# Altium schematic sheet 7971DoubleDriver.SchDoc
size A3
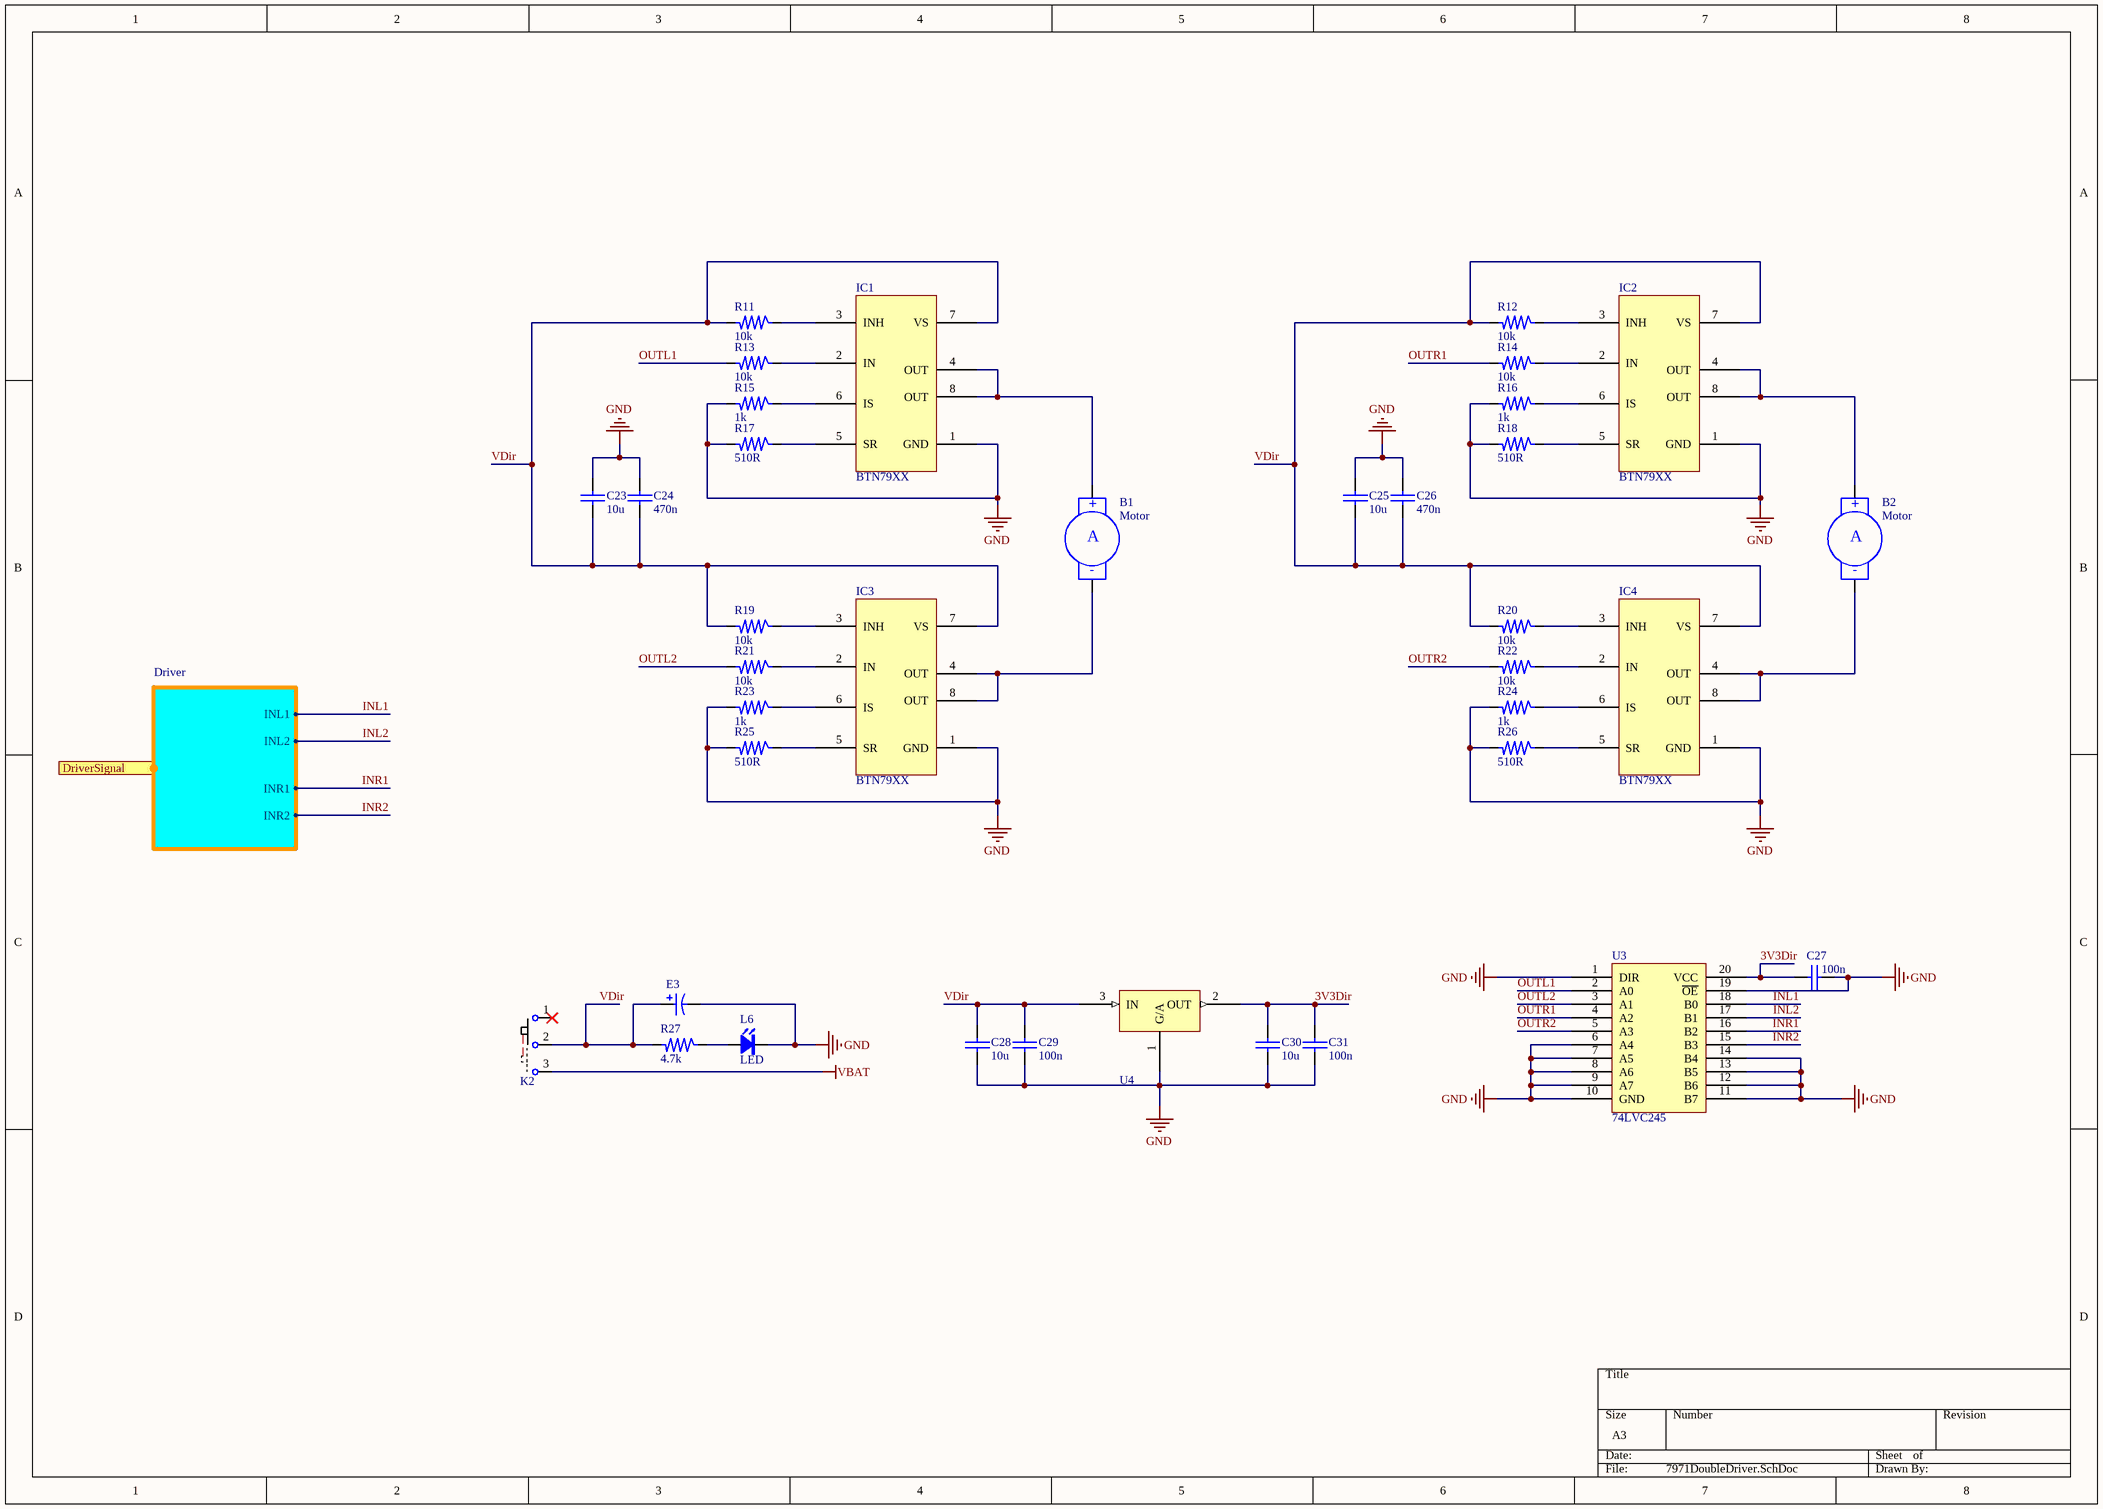
[diagram p0: 7971DoubleDriver.SchDoc]

## Parts
B1  Motor  [KF301-2P]
B2  Motor  [KF301-2P]
C23  10u  [C0805]
C24  470n  [C0603]
C25  10u  [C0805]
C26  470n  [C0603]
C27  100n  [C0603]
C28  10u  [C0805]
C29  100n  [C0603]
C30  10u  [C0805]
C31  100n  [C0603]
E3  100u  [CAP-E SMD-D]  (value not drawn)
IC1  BTN79XX  [PG-TO263-7-1]
IC2  BTN79XX  [PG-TO263-7-1]
IC3  BTN79XX  [PG-TO263-7-1]
IC4  BTN79XX  [PG-TO263-7-1]
K2  RES-SEL  [NIUZI_SWITCH]  (value not drawn)
L6  LED  [LED0805TB]
R11  10k  [R0603]
R12  10k  [R0603]
R13  10k  [R0603]
R14  10k  [R0603]
R15  1k  [R0603]
R16  1k  [R0603]
R17  510R  [R0603]
R18  510R  [R0603]
R19  10k  [R0603]
R20  10k  [R0603]
R21  10k  [R0603]
R22  10k  [R0603]
R23  1k  [R0603]
R24  1k  [R0603]
R25  510R  [R0603]
R26  510R  [R0603]
R27  4.7k  [R0603]
U3  74LVC245  [TSSOP20]
U4  AMS1117-XX  [SOT223]  (value not drawn)

## Ports
DriverSignal (harness Driver)

## Harnesses
Driver: INL1, INL2, INR1, INR2

## Nets
GND: C23.1 C24.2 C25.1 C26.2 C27.2 C28.2 C29.2 C30.2 C31.2 E3.2 IC1.1(GND) IC2.1(GND) IC3.1(GND) IC4.1(GND) L6.2(K) R15.1 R16.1 R17.1 R18.1 R23.1 R24.1 R25.1 R26.1 U3.1(DIR) U3.6(A4) U3.7(A5) U3.8(A6) U3.9(A7) U3.10(GND) U3.11(B7) U3.12(B6) U3.13(B5) U3.14(B4) U3.19(~{OE}) U4.1(G/A)
VBAT: K2.3
3V3Dir: C27.1 C30.1 C31.1 U3.20(VCC) U4.2(OUT)
INL1: U3.18(B0) ; port DriverSignal.INL1
INL2: U3.17(B1) ; port DriverSignal.INL2
INR1: U3.16(B2) ; port DriverSignal.INR1
INR2: U3.15(B3) ; port DriverSignal.INR2
OUTL1: R13.1 U3.2(A0)
OUTL2: R21.1 U3.3(A1)
OUTR1: R14.1 U3.4(A2)
OUTR2: R22.1 U3.5(A3)
VDir: C23.2 C24.1 C25.2 C26.1 C28.1 C29.1 E3.1 IC1.7(VS) IC2.7(VS) IC3.7(VS) IC4.7(VS) K2.2 R11.1 R12.1 R19.1 R20.1 R27.1 U4.3(IN)
NetB1_1: B1.1(+) IC1.4(OUT) IC1.8(OUT)
NetB1_2: B1.2(-) IC3.4(OUT) IC3.8(OUT)
NetB2_1: B2.1(+) IC2.4(OUT) IC2.8(OUT)
NetB2_2: B2.2(-) IC4.4(OUT) IC4.8(OUT)
NetIC1_2: IC1.2(IN) R13.2
NetIC1_3: IC1.3(INH) R11.2
NetIC1_5: IC1.5(SR) R17.2
NetIC1_6: IC1.6(IS) R15.2
NetIC2_2: IC2.2(IN) R14.2
NetIC2_3: IC2.3(INH) R12.2
NetIC2_5: IC2.5(SR) R18.2
NetIC2_6: IC2.6(IS) R16.2
NetIC3_2: IC3.2(IN) R21.2
NetIC3_3: IC3.3(INH) R19.2
NetIC3_5: IC3.5(SR) R25.2
NetIC3_6: IC3.6(IS) R23.2
NetIC4_2: IC4.2(IN) R22.2
NetIC4_3: IC4.3(INH) R20.2
NetIC4_5: IC4.5(SR) R26.2
NetIC4_6: IC4.6(IS) R24.2
NetL6_1: L6.1(A) R27.2

Not connected (* = marked no-connect by the designer): K2 1*

## Notes on the sheet
- (in symbol Motor Servo) A

## Library data of the parts
B1 B2 = Motor Servo: Servo Motor
C23-C31 = Capacitor: 电容
E3 = Capacitor-Polarity: 极性电容
IC1-IC4 = BTN79XX: BTN7960/7971/799X
K2 = RES-SEL: 扭子开关
R11-R27 = Resistor: 电阻
U3 = 74lvc245: 8位5伏转3.3伏电平转换芯片
U4 = AMS1117-XX: 稳压芯片